# Altium project 175-00024, rev2, Backplane, Instrument Crate.PrjPCB
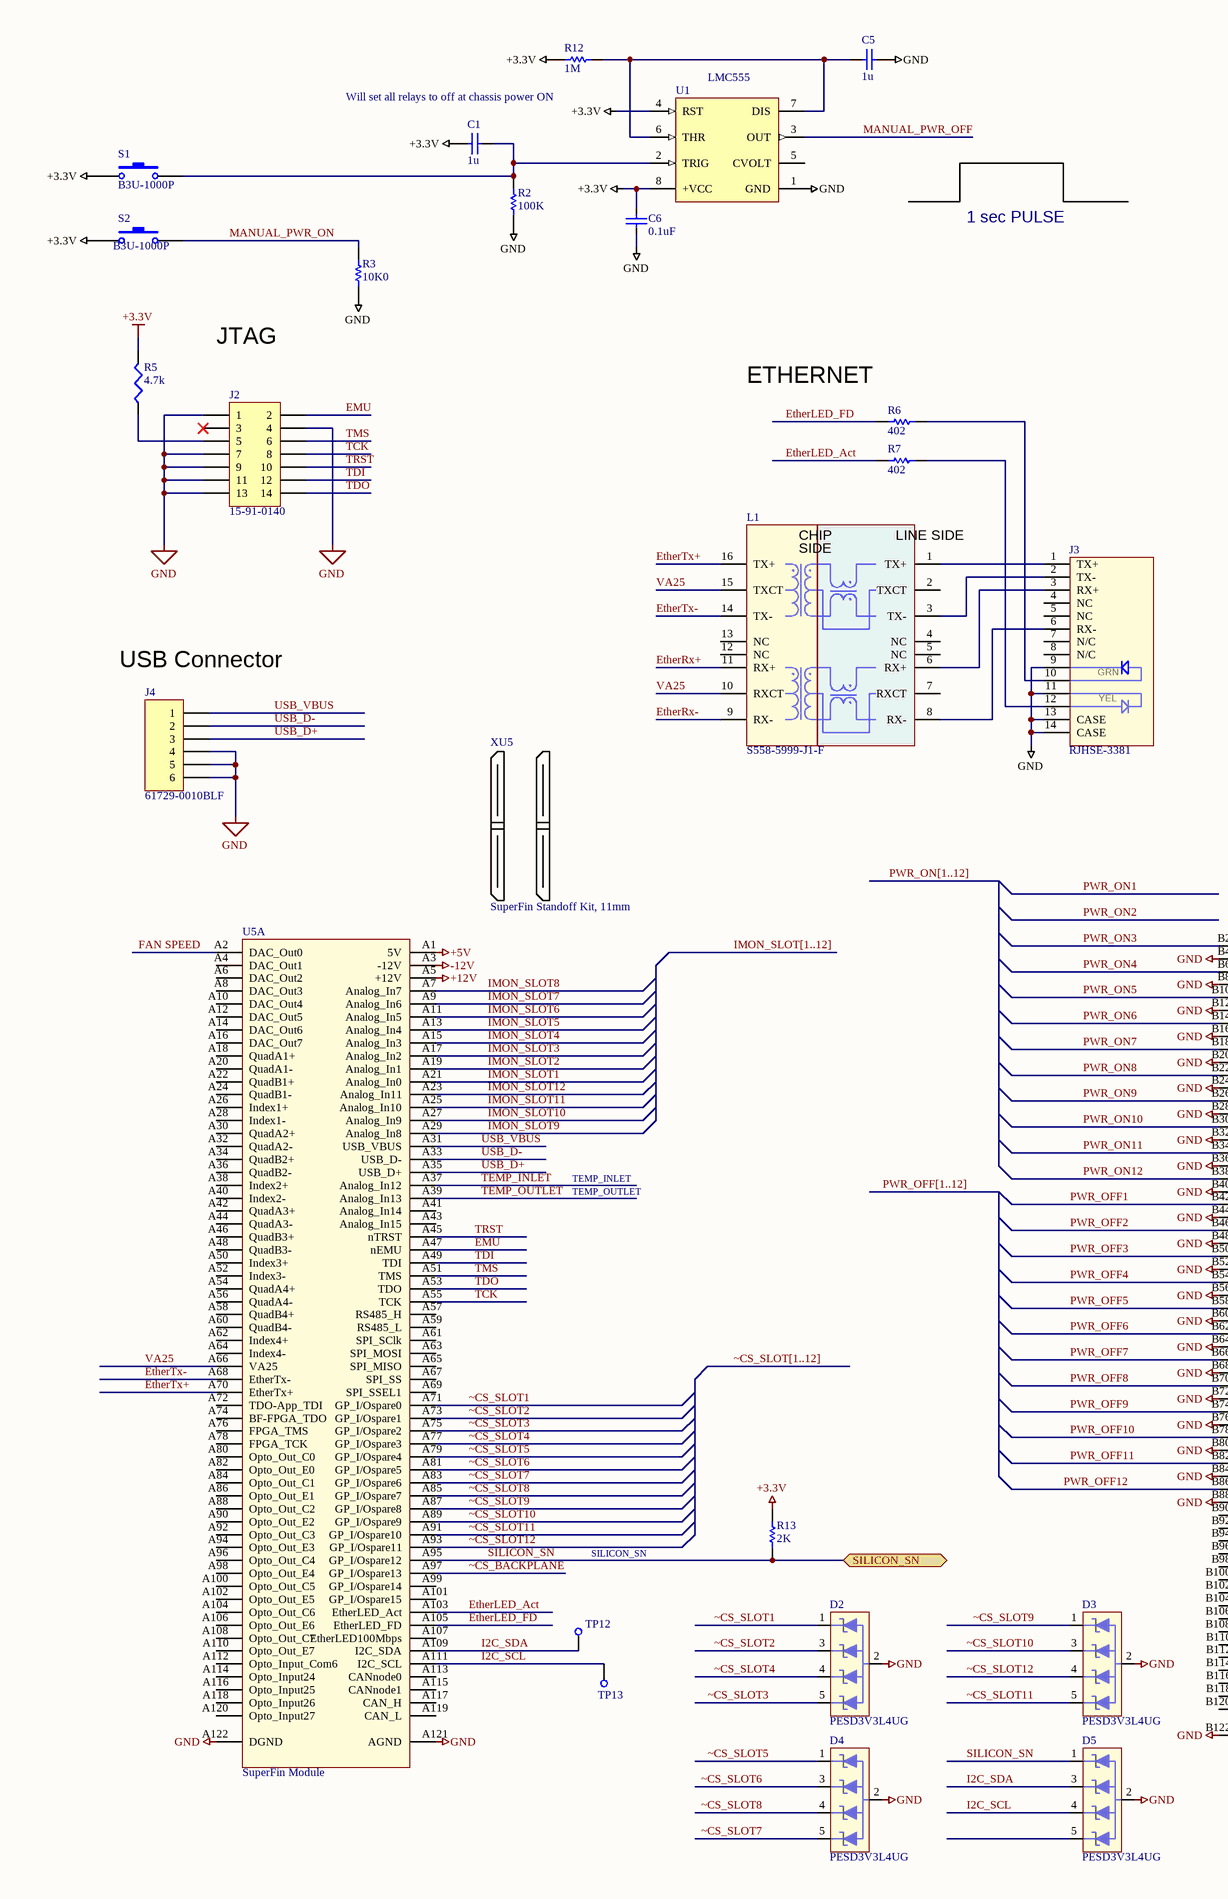
[diagram p0: 780-00029,rev2,Pg3,Backplane, Instrument Crate.SchDoc, left]
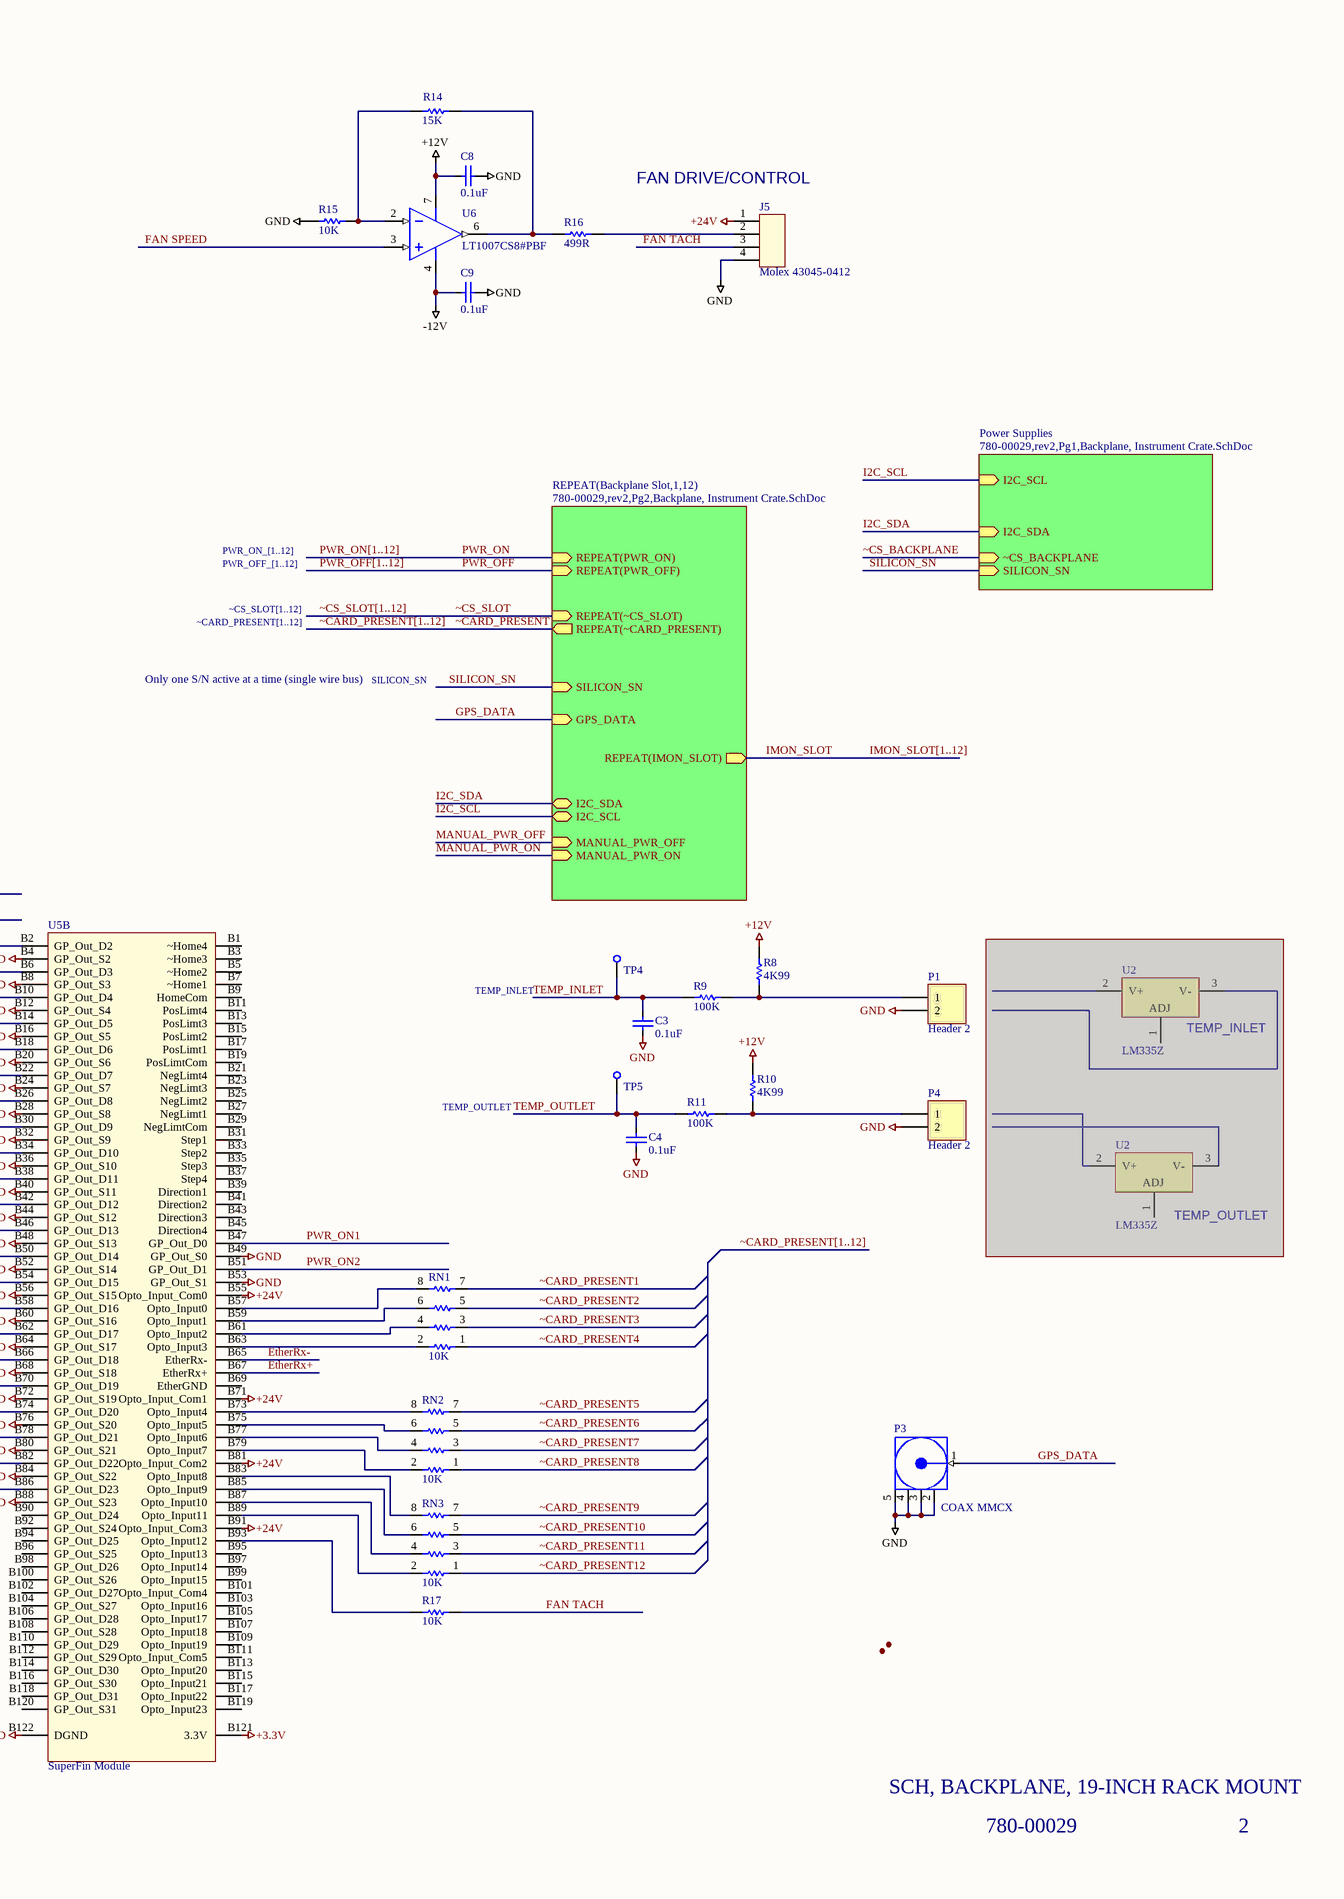
[diagram p1: 780-00029,rev2,Pg3,Backplane, Instrument Crate.SchDoc, right]
2 sheets, 103 parts. Net scope: hierarchical (ports join the sheet entries above them; power ports are global).
Board file: 175-00024_rev2, Backplane, Instrument Crate.PcbDoc
Sheets:
  780-00029,rev2,Pg3,Backplane, Instrument Crate.SchDoc
    Power Supplies = 780-00029,rev2,Pg1,Backplane, Instrument Crate.SchDoc

## Sheet 780-00029,rev2,Pg3,Backplane, Instrument Crate.SchDoc
size C; PageSetup: Record=PageOptions|CenterHorizontal=True|CenterVertical=True|PrintScale=0.70|XCorrection=1.00|YCorrection=1.00|PrintKind=0|BorderSize=5000000|LeftOffset=0|BottomOffset=0|Orientation=2|PaperLength=1000|PaperWidth=1000|Scale=100|PaperSource=7|PrintQuality=-4|MediaType=1|DitherType=10|PaperKind=Tabloid 11 x 17in|PrintScaleMode=1

### Parts
(Parts that share a designator on the sheet are numbered #1, #2 ... from top to bottom, then left to right.)
C1  1u  [2012[0805]]
C3  value 0.1uF  [SMD_0805]  (hidden comment: Cap SMD)
C4  value 0.1uF  [SMD_0805]  (hidden comment: Cap SMD)
C5  1u  [SMD_0805]
C6  value 0.1uF  [SMD_0805]  (hidden comment: Cap SMD)
C8  value 0.1uF  [SMD_0805]  (hidden comment: Cap SMD)
C9  value 0.1uF  [SMD_0805]  (hidden comment: Cap SMD)
D2  PESD3V3L4UG  [SOT-353]
D3  PESD3V3L4UG  [SOT-353]
D4  PESD3V3L4UG  [SOT-353]
D5  PESD3V3L4UG  [SOT-353]
J2  15-91-0140  [HDR2X7]
J3  RJHSE-3381  [RJ45, VERT MOUNT, NO MAGNETICS]
J4  61729-0010BLF  [USB Vertical PCB]
J5  Molex 43045-0412  [CONN Molex Micro-fit, 4 POS]
L1  S558-5999-J1-F  [10/100BT Magetics module]
P1  Header 2  [HDR1X2 for IDC]
P3  COAX MMCX  [MMCX2.54-V5]
P4  Header 2  [HDR1X2 for IDC]
R2  value 100K  [SMD_0805]  (hidden comment: Res 0805)
R3  value 10K0  [SMD_0805]  (hidden comment: Res 0805)
R5  4.7k  [2012[0805]]
R6  value 402  [SMD_0805]  (hidden comment: Res 0805)
R7  value 402  [SMD_0805]  (hidden comment: Res 0805)
R8  value 4K99  [SMD_0805]  (hidden comment: Res 0805)
R9  value 100K  [SMD_0805]  (hidden comment: Res 0805)
R10  value 4K99  [SMD_0805]  (hidden comment: Res 0805)
R11  value 100K  [SMD_0805]  (hidden comment: Res 0805)
R12  value 1M  [SMD_0805]  (hidden comment: Res 0805)
R13  value 2K  [SMD_0805]  (hidden comment: Res 0805)
R14  value 15K  [SMD_0805]  (hidden comment: Res 0805)
R15  value 10K  [SMD_0805]  (hidden comment: Res 0805)
R16  value 499R  [SMD_0805]  (hidden comment: Res 0805)
R17  value 10K  [SMD_0805]  (hidden comment: Res 0805)
RN1  value 10K  [RES ARRAY 0603 x 4]  (hidden comment: RES ARRAY  x4 10K)
RN2  value 10K  [RES ARRAY 0603 x 4]  (hidden comment: RES ARRAY  x4 10K)
RN3  value 10K  [RES ARRAY 0603 x 4]  (hidden comment: RES ARRAY  x4 10K)
S1  B3U-1000P  [B3U-1000P]
S2  B3U-1000P  [B3U-1000P]
TP4  Test Point SMD  [SMD_TEST POINT]  (value not drawn)
TP5  Test Point SMD  [SMD_TEST POINT]  (value not drawn)
TP12  Test Point SMD  [SMD_TEST POINT]  (value not drawn)
TP13  Test Point SMD  [SMD_TEST POINT]  (value not drawn)
U1  value LMC555  [M08A_M]  (hidden comment: LM555CMX)
U2#1  LM335Z  [Z03A]  (masked out: inside a compile mask, not in the netlist)
U2#2  LM335Z  [Z03A]  (masked out: inside a compile mask, not in the netlist)
U5  SuperFin Module  [SuperFin Footprint]  (parts A,B of 2)
U6  LT1007CS8#PBF  [S8_M]
XU5  SuperFin Standoff Kit, 11mm  (mechanical)

### Sub-sheets
Power Supplies = 780-00029,rev2,Pg1,Backplane, Instrument Crate.SchDoc: I2C_SCL (in), I2C_SDA (in), ~CS_BACKPLANE (in), SILICON_SN (in)
REPEAT(Backplane Slot,1,12) = 780-00029,rev2,Pg2,Backplane, Instrument Crate.SchDoc (file not in this document): MANUAL_PWR_OFF (in), MANUAL_PWR_ON (in), REPEAT(PWR_OFF) (in), REPEAT(PWR_ON) (in), GPS_DATA (in), I2C_SDA, I2C_SCL, REPEAT(~CS_SLOT) (in), REPEAT(~CARD_PRESENT) (out), SILICON_SN (in), REPEAT(IMON_SLOT) (out)

### Ports
SILICON_SN (bidir)

### Nets
+3.3V: C1.1 C6.2 R5.2 R12.1 R13.2 S1.1 S2.1 U1.4(RST) U1.8(+VCC) U5.B121(3.3V)
+5V: U5.A1(5V)
+12V: C8.1 R8.2 R10.2 U5.A5(+12V) U6.7(V+)
+24V: J5.1 U5.B55(Opto_Input_Com0) U5.B71(Opto_Input_Com1) U5.B81(Opto_Input_Com2) U5.B91(Opto_Input_Com3)
-12V: C9.1 U5.A3(-12V) U6.4(V-)
GND: C3.1 C4.1 C5.2 C6.1 C8.2 C9.2 D2.2 D3.2 D4.2 D5.2 J2.1 J2.4 J2.7 J2.9 J2.11 J2.13 J3.9(GRN-Anode) J3.11(YEL-Cathode) J3.13(CASE) J3.14(CASE) J4.4 J4.5 J4.6 J5.4 P1.2 P3.2(GND) P3.3(GND) P3.4(GND) P3.5(GND) P4.2 R2.1 R3.1 R15.1 U1.1(GND) U5.A121(AGND) U5.A122(DGND) U5.B4(GP_Out_S2) U5.B8(GP_Out_S3) U5.B12(GP_Out_S4) U5.B16(GP_Out_S5) U5.B20(GP_Out_S6) U5.B24(GP_Out_S7) U5.B28(GP_Out_S8) U5.B32(GP_Out_S9) U5.B36(GP_Out_S10) U5.B40(GP_Out_S11) U5.B44(GP_Out_S12) U5.B48(GP_Out_S13) U5.B49(GP_Out_S0) U5.B52(GP_Out_S14) U5.B53(GP_Out_S1) U5.B56(GP_Out_S15) U5.B60(GP_Out_S16) U5.B64(GP_Out_S17) U5.B68(GP_Out_S18) U5.B72(GP_Out_S19) U5.B76(GP_Out_S20) U5.B80(GP_Out_S21) U5.B84(GP_Out_S22) U5.B88(GP_Out_S23) U5.B122(DGND)
EMU: J2.2 U5.A47(nEMU)
EtherLED_Act: R7.1 U5.A103(EtherLED_Act)
EtherLED_FD: R6.1 U5.A105(EtherLED_FD)
EtherRx+: L1.11(RX+) U5.B67(EtherRx+)
EtherRx-: L1.9(RX-) U5.B65(EtherRx-)
EtherTx+: L1.16(TX+) U5.A70(EtherTx+)
EtherTx-: L1.14(TX-) U5.A68(EtherTx-)
FAN SPEED: U5.A2(DAC_Out0) U6.3(IN+)
FAN TACH: J5.3 R17.2
GPS_DATA: P3.1(Signal) ; sheet REPEAT(Backplane Slot,1,12)/GPS_DATA
I2C_SCL: D5.4 TP13.1(TP) U5.A111(I2C_SCL) ; sheet REPEAT(Backplane Slot,1,12)/I2C_SCL, sheet Power Supplies/I2C_SCL
I2C_SDA: D5.3 TP12.1(TP) U5.A109(I2C_SDA) ; sheet REPEAT(Backplane Slot,1,12)/I2C_SDA, sheet Power Supplies/I2C_SDA
IMON_SLOT: sheet REPEAT(Backplane Slot,1,12)/REPEAT(IMON_SLOT)
IMON_SLOT1: U5.A21(Analog_In0)
IMON_SLOT2: U5.A19(Analog_In1)
IMON_SLOT3: U5.A17(Analog_In2)
IMON_SLOT4: U5.A15(Analog_In3)
IMON_SLOT5: U5.A13(Analog_In4)
IMON_SLOT6: U5.A11(Analog_In5)
IMON_SLOT7: U5.A9(Analog_In6)
IMON_SLOT8: U5.A7(Analog_In7)
IMON_SLOT9: U5.A29(Analog_In8)
IMON_SLOT10: U5.A27(Analog_In9)
IMON_SLOT11: U5.A25(Analog_In10)
IMON_SLOT12: U5.A23(Analog_In11)
MANUAL_PWR_OFF: U1.3(OUT) ; sheet REPEAT(Backplane Slot,1,12)/MANUAL_PWR_OFF
MANUAL_PWR_ON: R3.2 S2.2 ; sheet REPEAT(Backplane Slot,1,12)/MANUAL_PWR_ON
PWR_OFF: sheet REPEAT(Backplane Slot,1,12)/REPEAT(PWR_OFF)
PWR_OFF1: U5.B42(GP_Out_D12)
PWR_OFF2: U5.B46(GP_Out_D13)
PWR_OFF3: U5.B50(GP_Out_D14)
PWR_OFF4: U5.B54(GP_Out_D15)
PWR_OFF5: U5.B58(GP_Out_D16)
PWR_OFF6: U5.B62(GP_Out_D17)
PWR_OFF7: U5.B66(GP_Out_D18)
PWR_OFF8: U5.B70(GP_Out_D19)
PWR_OFF9: U5.B74(GP_Out_D20)
PWR_OFF10: U5.B78(GP_Out_D21)
PWR_OFF11: U5.B82(GP_Out_D22)
PWR_OFF12: U5.B86(GP_Out_D23)
PWR_ON: sheet REPEAT(Backplane Slot,1,12)/REPEAT(PWR_ON)
PWR_ON1: U5.B47(GP_Out_D0)
PWR_ON2: U5.B51(GP_Out_D1)
PWR_ON3: U5.B2(GP_Out_D2)
PWR_ON4: U5.B6(GP_Out_D3)
PWR_ON5: U5.B10(GP_Out_D4)
PWR_ON6: U5.B14(GP_Out_D5)
PWR_ON7: U5.B18(GP_Out_D6)
PWR_ON8: U5.B22(GP_Out_D7)
PWR_ON9: U5.B26(GP_Out_D8)
PWR_ON10: U5.B30(GP_Out_D9)
PWR_ON11: U5.B34(GP_Out_D10)
PWR_ON12: U5.B38(GP_Out_D11)
SILICON_SN: D5.1 R13.1 U5.A95(GP_I/Ospare12) ; port SILICON_SN, sheet REPEAT(Backplane Slot,1,12)/SILICON_SN, sheet Power Supplies/SILICON_SN
TCK: J2.8 U5.A55(TCK)
TDI: J2.12 U5.A49(TDI)
TDO: J2.14 U5.A53(TDO)
TEMP_INLET: C3.2 R9.1 TP4.1(TP) U5.A37(Analog_In12)
TEMP_OUTLET: C4.2 R11.1 TP5.1(TP) U5.A39(Analog_In13)
TMS: J2.6 U5.A51(TMS)
TRST: J2.10 U5.A45(nTRST)
USB_D+: J4.3 U5.A35(USB_D+)
USB_D-: J4.2 U5.A33(USB_D-)
USB_VBUS: J4.1 U5.A31(USB_VBUS)
VA25: L1.10(RXCT) L1.15(TXCT) U5.A66(VA25)
~CARD_PRESENT: sheet REPEAT(Backplane Slot,1,12)/REPEAT(~CARD_PRESENT)
~CARD_PRESENT1: RN1.7
~CARD_PRESENT2: RN1.5
~CARD_PRESENT3: RN1.3
~CARD_PRESENT4: RN1.1
~CARD_PRESENT5: RN2.7
~CARD_PRESENT6: RN2.5
~CARD_PRESENT7: RN2.3
~CARD_PRESENT8: RN2.1
~CARD_PRESENT9: RN3.7
~CARD_PRESENT10: RN3.5
~CARD_PRESENT11: RN3.3
~CARD_PRESENT12: RN3.1
~CS_BACKPLANE: U5.A97(GP_I/Ospare13) ; sheet Power Supplies/~CS_BACKPLANE
~CS_SLOT: sheet REPEAT(Backplane Slot,1,12)/REPEAT(~CS_SLOT)
~CS_SLOT1: D2.1 U5.A71(GP_I/Ospare0)
~CS_SLOT2: D2.3 U5.A73(GP_I/Ospare1)
~CS_SLOT3: D2.5 U5.A75(GP_I/Ospare2)
~CS_SLOT4: D2.4 U5.A77(GP_I/Ospare3)
~CS_SLOT5: D4.1 U5.A79(GP_I/Ospare4)
~CS_SLOT6: D4.3 U5.A81(GP_I/Ospare5)
~CS_SLOT7: D4.5 U5.A83(GP_I/Ospare6)
~CS_SLOT8: D4.4 U5.A85(GP_I/Ospare7)
~CS_SLOT9: D3.1 U5.A87(GP_I/Ospare8)
~CS_SLOT10: D3.3 U5.A89(GP_I/Ospare9)
~CS_SLOT11: D3.5 U5.A91(GP_I/Ospare10)
~CS_SLOT12: D3.4 U5.A93(GP_I/Ospare11)
NetC1_2: C1.2 R2.2 S1.2 U1.2(TRIG)
NetC5_1: C5.1 R12.2 U1.6(THR) U1.7(DIS)
NetJ2_5: J2.5 R5.1
NetJ3_1: J3.1(TX+) L1.1(TX+)
NetJ3_2: J3.2(TX-) L1.3(TX-)
NetJ3_3: J3.3(RX+) L1.6(RX+)
NetJ3_6: J3.6(RX-) L1.8(RX-)
NetJ3_10: J3.10(GRN-Cathode) R6.2
NetJ3_12: J3.12(YEL-Anode) R7.2
NetJ5_2: J5.2 R16.1
NetP1_1: P1.1 R8.1 R9.2
NetP4_1: P4.1 R10.1 R11.2
NetR14_1: R14.1 R15.2 U6.2(IN-)
NetR14_2: R14.2 R16.2 U6.6(OUT)
NetR17_1: R17.1 U5.B93(Opto_Input12)
NetRN1_2: RN1.2 U5.B63(Opto_Input3)
NetRN1_4: RN1.4 U5.B61(Opto_Input2)
NetRN1_6: RN1.6 U5.B59(Opto_Input1)
NetRN1_8: RN1.8 U5.B57(Opto_Input0)
NetRN2_2: RN2.2 U5.B79(Opto_Input7)
NetRN2_4: RN2.4 U5.B77(Opto_Input6)
NetRN2_6: RN2.6 U5.B75(Opto_Input5)
NetRN2_8: RN2.8 U5.B73(Opto_Input4)
NetRN3_2: RN3.2 U5.B89(Opto_Input11)
NetRN3_4: RN3.4 U5.B87(Opto_Input10)
NetRN3_6: RN3.6 U5.B85(Opto_Input9)
NetRN3_8: RN3.8 U5.B83(Opto_Input8)

Not connected (* = marked no-connect by the designer): D5 5; J2 3*; J3 4(NC) 5(NC) 7(N/C) 8(N/C); L1 2(TXCT) 4(NC) 5(NC) 7(RXCT) 12(NC) 13(NC); U1 5(CVOLT); U5 A4(DAC_Out1) A6(DAC_Out2) A8(DAC_Out3) A10(DAC_Out4) A12(DAC_Out5) A14(DAC_Out6) A16(DAC_Out7) A18(QuadA1+) A20(QuadA1-) A22(QuadB1+) A24(QuadB1-) A26(Index1+) A28(Index1-) A30(QuadA2+) A32(QuadA2-) A34(QuadB2+) A36(QuadB2-) A38(Index2+) A40(Index2-) A41(Analog_In14) A42(QuadA3+) A43(Analog_In15) A44(QuadA3-) A46(QuadB3+) A48(QuadB3-) A50(Index3+) A52(Index3-) A54(QuadA4+) A56(QuadA4-) A57(RS485_H) A58(QuadB4+) A59(RS485_L) A60(QuadB4-) A61(SPI_SClk) A62(Index4+) A63(SPI_MOSI) A64(Index4-) A65(SPI_MISO) A67(SPI_SS) A69(SPI_SSEL1) A72(TDO-App_TDI) A74(BF-FPGA_TDO) A76(FPGA_TMS) A78(FPGA_TCK) A80(Opto_Out_C0) A82(Opto_Out_E0) A84(Opto_Out_C1) A86(Opto_Out_E1) A88(Opto_Out_C2) A90(Opto_Out_E2) A92(Opto_Out_C3) A94(Opto_Out_E3) A96(Opto_Out_C4) A98(Opto_Out_E4) A99(GP_I/Ospare14) A100(Opto_Out_C5) A101(GP_I/Ospare15) A102(Opto_Out_E5) A104(Opto_Out_C6) A106(Opto_Out_E6) A107(EtherLED100Mbps) A108(Opto_Out_C7) A110(Opto_Out_E7) A112(Opto_Input_Com6) A113(CANnode0) A114(Opto_Input24) A115(CANnode1) A116(Opto_Input25) A117(CAN_H) A118(Opto_Input26) A119(CAN_L) A120(Opto_Input27) B1(~Home4) B3(~Home3) B5(~Home2) B7(~Home1) B9(HomeCom) B11(PosLimt4) B13(PosLimt3) B15(PosLimt2) B17(PosLimt1) B19(PosLimtCom) B21(NegLimt4) B23(NegLimt3) B25(NegLimt2) B27(NegLimt1) B29(NegLimtCom) B31(Step1) B33(Step2) B35(Step3) B37(Step4) B39(Direction1) B41(Direction2) B43(Direction3) B45(Direction4) B69(EtherGND) B90(GP_Out_D24) B92(GP_Out_S24) B94(GP_Out_D25) B95(Opto_Input13) B96(GP_Out_S25) B97(Opto_Input14) B98(GP_Out_D26) B99(Opto_Input15) B100(GP_Out_S26) B101(Opto_Input_Com4) B102(GP_Out_D27) B103(Opto_Input16) B104(GP_Out_S27) B105(Opto_Input17) B106(GP_Out_D28) B107(Opto_Input18) B108(GP_Out_S28) B109(Opto_Input19) B110(GP_Out_D29) B111(Opto_Input_Com5) B112(GP_Out_S29) B113(Opto_Input20) B114(GP_Out_D30) B115(Opto_Input21) B116(GP_Out_S30) B117(Opto_Input22) B118(GP_Out_D31) B119(Opto_Input23) B120(GP_Out_S31); U6 1(VOSTRIM) 5(NC) 8(VOSTRIM)

### Buses and harness runs
bus IMON_SLOT[1..12]
bus PWR_OFF[1..12]
bus PWR_ON[1..12]
bus ~CARD_PRESENT[1..12]
bus ~CS_SLOT[1..12]

### Notes on the sheet
- Will set all relays to off at chassis power ON
- (near J5) FAN DRIVE/CONTROL
- 1 sec PULSE
- JTAG
- ETHERNET
- PWR_OFF_[1..12]
- PWR_ON_[1..12]
- ~CARD_PRESENT[1..12]
- ~CS_SLOT[1..12]
- (near J4) USB Connector
- Only one S/N active at a time (single wire bus)
- SILICON_SN
- TEMP_INLET
- (near U2#1) TEMP_INLET
- TEMP_OUTLET
- (near U2#2) TEMP_OUTLET
- SCH, BACKPLANE, 19-INCH RACK MOUNT
- 780-00029
- 2
- (in symbol CONN RJ-45 w/o magnetics) GRN; YEL
- (in symbol Ethernet Magnetics module) CHIP; LINE SIDE; SIDE

### Library data of the parts
C1 C5 = Cap: Capacitor; Manufacturer: Taiyo Yuden; Manuf p/n: UMK212F105ZG-T; Vendor: DIGIKEY; Vendor Mult.: 10; Vendor p/n: 587-1308-1-ND; LCO p/n: 120-00027; Value: 1u; COST: 0.088
C3 C4 C6 C8 C9 = Cap SMD: Capacitor; LCO p/n: 120-00002
D2-D5 = ESD Diode 3.3V Quad: Quad ESD Diode 3.3V; Manufacturer: NXP; Manuf p/n: PESD3V3L4UG,115; LCO p/n: 140-00011; VALUE: 3V3; Vendor: DigiKey; Vendor Mult.: 1; Vendor p/n: 568-4042-1-ND; COST: 0.52
J2 = Header 7X2: Header, 7-Pin, Dual row; Manufacturer: Molex/Waldom; Vendor: DIGIKEY; Vendor Mult.: 1; LCO p/n: 125-00005; Value: HEADER 7X2
J3 = CONN RJ-45 w/o magnetics: Vertical PC mount, w/o magnetics; LCO p/n: 125-00040
J4 = Header 6: Header, 6-Pin; Manufacturer: FCI; Value: USB TYPE B; Vendor: DigiKey; Vendor Mult.: 1; LCO p/n: 125-00039; COST: 1.12
J5 = CONN 4 pin 3mm: Molex Micro Fit 3, Vert PC mount; LCO p/n: 125-00121; Vendor: Digi-Key; Vendor Mult.: 1; Vendor p/n: WM1790-ND; Manufacturer: Molex; Manuf p/n: 43045-0412
L1 = Ethernet Magnetics module: 10/100BT Magnetics Module; LCO p/n: 155-00014
P1 P4 = Header 2: Header, 2-Pin; Manufacturer: TE Connectivity; Manuf p/n: 640456-2; Vendor: Digi-Key; Vendor p/n: A1921-ND; LCO p/n: 125-00110; VALUE: Header 2
P3 = COAX-M: RF Coaxial PCB Connector, MMCX; Thru-Hole, Vertical Mount Plug,  50 Ohm Impedance; Manufacturer: Emerson; Manuf p/n: 135-3701-201; Vendor: DigiKey; Vendor p/n: J597-ND; VALUE: COAX-M; Vendor Mult.: 1; LCO p/n: 125-00054; COST: 5.24
R2 R9 R11 = Res SMD: Resistor 0805; Manufacturer: Vishay/Dale; Manuf p/n: CRCW0805100KFKEA; Vendor: DIGIKEY; Vendor p/n: 541-100KCCT-ND; Vendor Mult.: 10; LCO p/n: 181-01003; COST: 0.09
R3 = Res SMD: Resistor 0805; Manufacturer: Vishay/Dale; Manuf p/n: CRCW080510K0FKEA; Vendor: DIGIKEY; Vendor p/n: 541-10K0CCT-ND; Vendor Mult.: 10; LCO p/n: 181-01002; COST: 0.09
R5 = Res3: Resistor; Manufacturer: Dale/Vishay; Manuf p/n: CRCW08054.75KFKEA; Value: 4.75K; Vendor: DIGIKEY; Vendor Mult.: 10; Vendor p/n: 541-4.75KCCT-ND; LCO p/n: 181-04751; COST: 0.08
R6 R7 = Res SMD: Resistor 0805; Manufacturer: Vishay/Dale; Manuf p/n: CRCW0805402FKEA; Vendor: DIGIKEY; Vendor p/n: 541-402CCT-ND; Vendor Mult.: 10; LCO p/n: 181-04020; COST: 0.09
R8 R10 = Res SMD: Resistor 0805; Manufacturer: Vishay/Dale; Manuf p/n: CRCW08054K99FKEA; Vendor: DIGIKEY; Vendor p/n: 541-4K99CCT-ND; Vendor Mult.: 10; LCO p/n: 181-04991; COST: 0.09
R12 = Res SMD: Resistor 0805; Manufacturer: Vishay/Dale; Vendor: DIGIKEY; LCO p/n: 181-01004; COST: 0.09
R13 = Res SMD: Resistor 0805; Manufacturer: Vishay/Dale; Manuf p/n: CRCW08052KFKEA; Vendor: DIGIKEY; Vendor p/n: 541-2KCCT-ND; Vendor Mult.: 10; LCO p/n: 181-02001; COST: 0.09
R14 = Res SMD: Resistor 0805; Manufacturer: Vishay/Dale; Manuf p/n: CRCW080515KFKEA; Vendor: DIGIKEY; Vendor p/n: 541-15KCCT-ND; Vendor Mult.: 10; LCO p/n: 181-01502; COST: 0.09
R15 R17 = Res SMD: Resistor 0805; Manufacturer: Vishay/Dale; Manuf p/n: CRCW080510KFKEA; Vendor: DIGIKEY; Vendor p/n: 541-10KCCT-ND; Vendor Mult.: 10; LCO p/n: 181-01002; COST: 0.09
R16 = Res SMD: Resistor 0805; Manufacturer: Vishay/Dale; Manuf p/n: CRCW0805499RFKEA; Vendor: DIGIKEY; Vendor p/n: 541-499RCCT-ND; Vendor Mult.: 10; LCO p/n: 181-04990; COST: 0.09
RN1-RN3 = RES ARRAY  x4 10K: Resistor Array 4 Isolated; Manufacturer: PANASONIC - ECG; Manuf p/n: EXB-38V103JV; Vendor: DIGIKEY; Vendor p/n: Y9103CT-ND; Vendor Mult.: 10; LCO p/n: 180-00043; COST: 0.03
S1 S2 = SW-PB: Switch; Manufacturer: Omron Electronics; Vendor: DIGIKEY; Vendor Mult.: 1; Vendor p/n: SW1020CT-ND; Value: SW PB; LCO p/n: 185-00005; COST: 0.96; Manuf p/n: B3U-1000P
TP4 TP5 TP12 TP13 = Test Point SMD: SMD loop test point; LCO p/n: 160-00001; VALUE: Test Point SMD
U1 = LM555CMX: Timer; Manufacturer: National Semiconductor; Manuf p/n: LMC555CMX/NOPB; LCO p/n: 150-00090; Vendor: Digi-Key; Vendor Mult.: 1; Vendor p/n: LMC555CMXCT-ND
U2#1 U2#2 = LM335Z: Precision Temperature Sensor; Manufacturer: National Semiconductor; LCO p/n: 150-00068
U5 = SuperFin Module: LCO p/n: 830-00010
U6 = LT1007CS8#PBF: Low Noise BJT input opamp; Manufacturer: Linear Tech; LCO p/n: 150-00067; VALUE: LT1007; Vendor: DigiKey; Vendor Mult.: 1; Vendor p/n: LT1007CS8#PBF-ND; COST: 4.13; Manuf p/n: LT1007CS8#PBF
XU5 = SuperFin Standoff Kit, 11mm: LCO p/n: 810-00005

## Sheet 780-00029,rev2,Pg1,Backplane, Instrument Crate.SchDoc
size B; PageSetup: Record=PageOptions|CenterHorizontal=True|CenterVertical=True|PrintScale=1.09|XCorrection=1.00|YCorrection=1.00|PrintKind=0|BorderSize=5000000|LeftOffset=0|BottomOffset=0|Orientation=2|PaperLength=1000|PaperWidth=1000|Scale=100|PaperSource=7|PrintQuality=-4|MediaType=1|DitherType=10|PaperKind=Tabloid 11 x 17in|PrintScaleMode=1
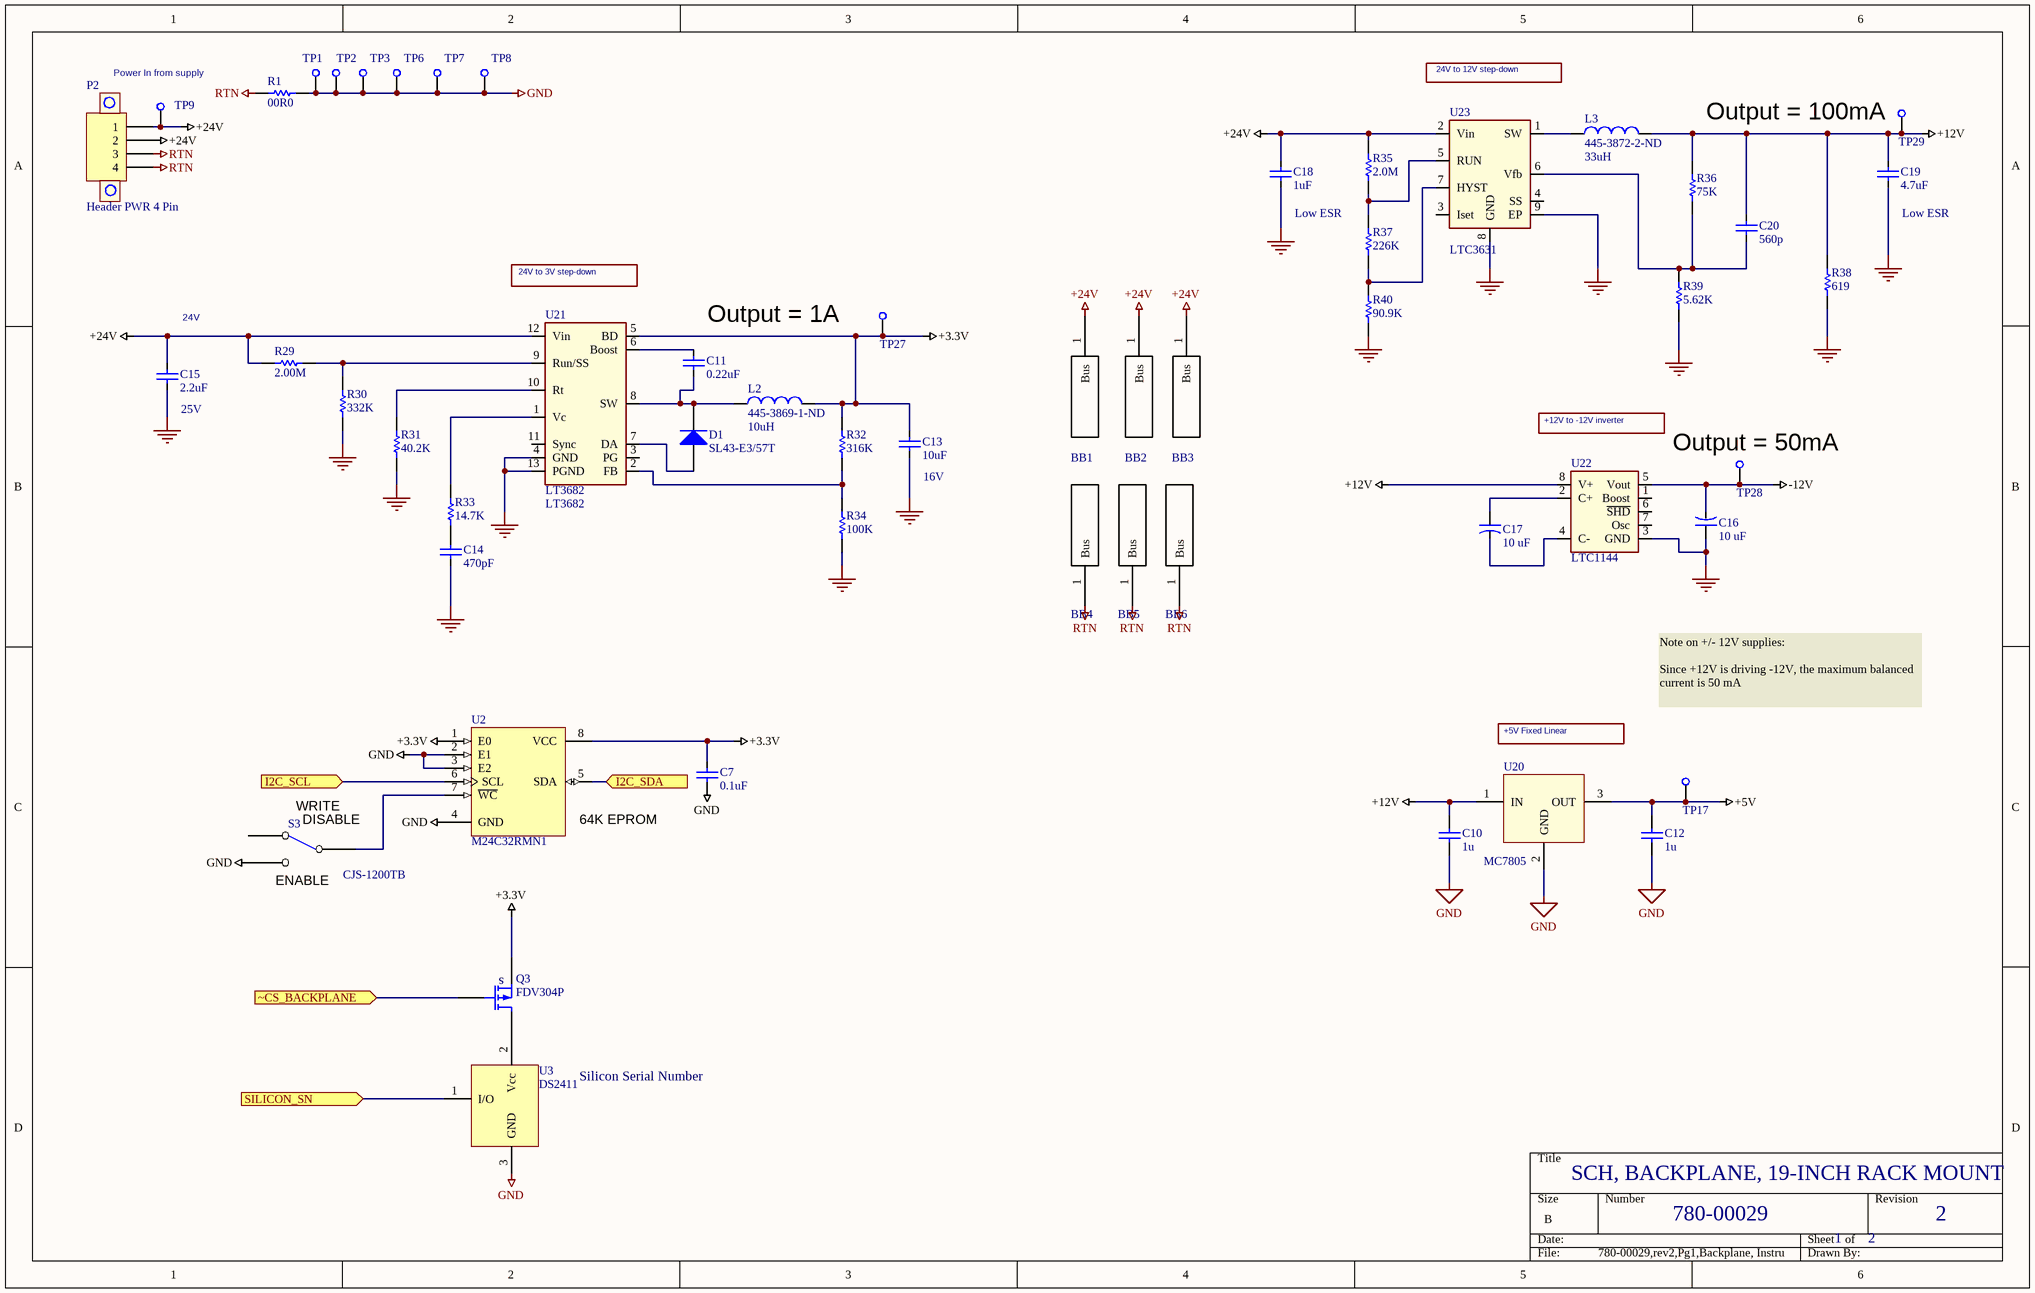
[diagram p2: 780-00029,rev2,Pg1,Backplane, Instrument Crate.SchDoc]

### Parts
(Parts that share a designator on the sheet are numbered #1, #2 ... from top to bottom, then left to right.)
BB1  Bus Bar  [Bus Bar 1.5" pitch]  (value not drawn)
BB2  Bus Bar  [Bus Bar 1.5" pitch]  (value not drawn)
BB3  Bus Bar  [Bus Bar 1.5" pitch]  (value not drawn)
BB4  Bus Bar  [Bus Bar 1.5" pitch]  (value not drawn)
BB5  Bus Bar  [Bus Bar 1.5" pitch]  (value not drawn)
BB6  Bus Bar  [Bus Bar 1.5" pitch]  (value not drawn)
C7  value 0.1uF  [SMD_0805]  (hidden comment: Cap SMD)
C10  1u  [2012[0805]]
C11  value 0.22uF  [SMD_0805]  (hidden comment: Cap SMD)
C12  1u  [2012[0805]]
C13  16V  value 10uF  [SMD_0805]
C14  value 470pF  [SMD_0805]  (hidden comment: Cap SMD)
C15  25V  value 2.2uF  [SMD_0805]
C16  value 10 uF  [SMD_CAP_3216]  (hidden comment: 16V)
C17  value 10 uF  [SMD_CAP_3216]  (hidden comment: 16V)
C18  Low ESR  value 1uF  [SMD_1206]
C19  Low ESR  value 4.7uF  [SMD_1206]
C20  value 560p  [SMD_0805]  (hidden comment: Cap SMD)
D1  SL43-E3/57T  [DO-214AB]
L2  445-3869-1-ND  value 10uH  [Inductor TDC SLF]
L3  445-3872-2-ND  value 33uH  [Inductor TDC SLF]
P2  Header PWR 4 Pin  [HDR-4 pin w/screw]
Q3  FDV304P  [SMD_SOT23_3]
R1  value 00R0  [SMD_0805]  (hidden comment: Res 0805)
R29  value 2.00M  [SMD_0805]  (hidden comment: Res 0805)
R30  value 332K  [SMD_0805]  (hidden comment: Res 0805)
R31  value 40.2K  [SMD_0805]  (hidden comment: Res 0805)
R32  value 316K  [SMD_0805]  (hidden comment: Res 0805)
R33  value 14.7K  [SMD_0805]  (hidden comment: Res 0805)
R34  value 100K  [SMD_0805]  (hidden comment: Res 0805)
R35  value 2.0M  [SMD_0805]  (hidden comment: Res 0805)
R36  value 75K  [SMD_0805]  (hidden comment: Res 0805)
R37  value 226K  [SMD_0805]  (hidden comment: Res 0805)
R38  value 619  [SMD_0805]  (hidden comment: Res 0805)
R39  value 5.62K  [SMD_0805]  (hidden comment: Res 0805)
R40  value 90.9K  [SMD_0805]  (hidden comment: Res 0805)
S3  CJS-1200TB  [CAS-120B]
TP1  Test point  [PAD_80D_052H]  (value not drawn)
TP2  Test point  [PAD_80D_052H]  (value not drawn)
TP3  Test point  [PAD_80D_052H]  (value not drawn)
TP6  Test point  [PAD_80D_052H]  (value not drawn)
TP7  Test point  [PAD_80D_052H]  (value not drawn)
TP8  Test point  [PAD_80D_052H]  (value not drawn)
TP9  Test Point SMD  [SMD_TEST POINT]  (value not drawn)
TP17  Test Point SMD  [SMD_TEST POINT]  (value not drawn)
TP27  Test Point SMD  [SMD_TEST POINT]  (value not drawn)
TP28  Test Point SMD  [SMD_TEST POINT]  (value not drawn)
TP29  Test Point SMD  [SMD_TEST POINT]  (value not drawn)
U2#3  M24C32RMN1  [SOP8_N]
U3  DS2411  [SMD_SOT23_3]
U20  value MC7805  [TO-252(D-PAK)  PowerPAD]  (hidden comment: Voltage Reg, Fixed)
U21  LT3682  [DD12/DFN12]
U22  LTC1144  [S8_M]
U23  LTC3631  [DD8/DFN8]

### Ports
I2C_SCL (in), I2C_SDA (in), SILICON_SN (in), ~CS_BACKPLANE (in)

### Nets
+3.3V: C7.2 C13.2 L2.2 Q3.2(S) R32.2 TP27.1(TP) U2#3.1(E0) U2#3.8(VCC) U21.5(BD)
+5V: C12.1 TP17.1(TP) U20.3(OUT)
+12V: C10.1 C19.2 C20.2 L3.2 R36.2 R38.2 TP29.1(TP) U20.1(IN) U22.8(V+)
+24V: BB1.1(Bus) BB2.1(Bus) BB3.1(Bus) C15.2 C18.2 P2.1 P2.2 R29.1 R35.2 TP9.1(TP) U21.12(Vin) U23.2(Vin)
-12V: C16.2 TP28.1(TP) U22.5(Vout)
GND: C7.1 C10.2 C12.2 C13.1 C14.1 C15.1 C16.1 C18.1 C19.1 R1.2 R30.1 R31.1 R34.1 R38.1 R39.1 R40.1 S3.1(NO) TP1.1(TP) TP2.1(TP) TP3.1(TP) TP6.1(TP) TP7.1(TP) TP8.1(TP) U2#3.2(E1) U2#3.3(E2) U2#3.4(GND) U3.3(GND) U20.2(GND) U21.4(GND) U21.13(PGND) U22.3(GND) U23.8(GND) U23.9(EP)
RTN: BB4.1(Bus) BB5.1(Bus) BB6.1(Bus) P2.3 P2.4 R1.1
I2C_SCL: U2#3.6(SCL) ; port I2C_SCL
I2C_SDA: U2#3.5(SDA) ; port I2C_SDA
SILICON_SN: U3.1(I/O) ; port SILICON_SN
~CS_BACKPLANE: Q3.1(G) ; port ~CS_BACKPLANE
NetC11_1: C11.1 D1.2(K) L2.1 U21.8(SW)
NetC11_2: C11.2 U21.6(Boost)
NetC14_2: C14.2 R33.1
NetC17_1: C17.1 U22.2(C+)
NetC17_2: C17.2 U22.4(C-)
NetC20_1: C20.1 R36.1 R39.2 U23.6(Vfb)
NetD1_1: D1.1(A) U21.7(DA)
NetL3_1: L3.1 U23.1(SW)
NetQ3_3: Q3.3(D) U3.2(Vcc)
NetR29_2: R29.2 R30.2 U21.9(Run/SS)
NetR31_2: R31.2 U21.10(Rt)
NetR32_1: R32.1 R34.2 U21.2(FB)
NetR33_2: R33.2 U21.1(Vc)
NetR35_1: R35.1 R37.2 U23.5(RUN)
NetR37_1: R37.1 R40.2 U23.7(HYST)
NetS3_2: S3.2(COM) U2#3.7(~{WC})

Not connected (* = marked no-connect by the designer): S3 3(NC); U21 3(PG) 11(Sync); U22 1(Boost) 6(~{SHD}) 7(Osc); U23 3(Iset) 4(SS)

### Notes on the sheet
- Power In from supply
- 24V to 12V step-down
- Output = 100mA
- 24V to 3V step-down
- (near C15) 24V
- Output = 1A
- +12V to -12V inverter
- (near TP28) Output = 50mA
- Note on +/- 12V supplies:
  Since +12V is driving -12V, the maximum balanced current is 50 mA
- +5V Fixed Linear
- (near S3) WRITE
- (near S3) DISABLE
- (near U2#3) 64K EPROM
- (near S3) ENABLE
- Silicon Serial Number
- SCH, BACKPLANE, 19-INCH RACK MOUNT
- 780-00029
- 1
- 2
- (in symbol FDV304P) s

### Library data of the parts
BB1-BB6 = Bus Bar: Manufacturer: Circuit Components Inc.; Manuf p/n: B250-4-1.5-FO; LCO p/n: 160-00005; Value: Bus Bar; Vendor: Circuit Components Inc.; Vendor p/n: B250-4-1.5-FO
C7 = Cap SMD: Capacitor; Manufacturer: AVX; Manuf p/n: 08055C104KAT2A; Vendor: DigiKey; Vendor p/n: 478-1395-1-ND; Vendor Mult.: 10; LCO P/N: 120-00002; COST: 0.088
C10 C12 = Cap: as C1 on sheet 780-00029,rev2,Pg3,Backplane, Instrument Crate; Value: 1u; COST: 0.088
C11 = Cap SMD: Capacitor; LCO p/n: 120-00042
C13 = Cap SMD: Capacitor; LCO p/n: 120-00007
C14 = Cap SMD: Capacitor; LCO p/n: 120-00037
C15 = Cap SMD: Capacitor; Manufacturer: Taiyo Yuden; Manuf p/n: TMK212BJ225KG-T; Vendor: Digi-Key; Vendor p/n: 587-1292-1-ND; Vendor Mult.: 10; LCO p/n: 120-00038; COST: 0.275
C16 C17 = Cap Tant 16V: outline 3.2mm x 1.6mm; Manufacturer: KEMET; Manuf p/n: T494A106M016AT; Vendor: DIGIKEY; Vendor p/n: 399-3824-1-ND; Vendor Mult.: 1; LCO p/n: 120-00001; COST: 0.78
C18 = Cap SMD: Capacitor; Manufacturer: TDK; Manuf p/n: C3225X7R1H105K/1.6; Vendor: Digi-Key; Vendor p/n: 445-3931-1-ND; Vendor Mult.: 10; LCO p/n: 120-00039
C19 = Cap SMD: Capacitor; Manufacturer: TDK; Manuf p/n: C3216X7R1E475K; Vendor: Digi-Key; Vendor p/n: 445-1606-1-ND; Vendor Mult.: 10; LCO p/n: 120-00040
C20 = Cap SMD: Capacitor; LCO p/n: 120-00036
D1 = Diode: Default Diode; Manufacturer: Vishay/Dale; Value: 4A 30V; Vendor: DigiKey; Vendor Mult.: 1; Vendor p/n: SL43-E3/57TGICT-ND; LCO p/n: 140-00002; COST: 0.98; Manuf p/n: SL43-E3/57T
L2 = Inductor SMD 10uH 1.8A: Inductor; Manufacturer: TDK; Manuf p/n: SLF7045T-100M1R8-H; Vendor: Digi-Key; Vendor Mult.: 1; LCO p/n: 155-00015; Vendor p/n: 445-3869-1-ND
L3 = Inductor SMD 10uH 1.8A: Inductor; Manufacturer: TDK; Manuf p/n: SLF7045T-330M1R1-H; Vendor: Digi-Key; Vendor Mult.: 1; LCO p/n: 155-00016; Vendor p/n: 445-3872-2-ND
P2 = Header 4 PWR: Header, 4-Pin; Manufacturer: tyco; Manuf p/n: 796867-4; Vendor: Digi-key; Vendor p/n: A98457-ND; Vendor Mult.: 1; LCO p/n: 125-00082; VALUE: Header 4-pin PWR
Q3 = FDV304P: P-MOSFET LOGIC LEVEL; Manufacturer: Fairchild; Vendor: DigiKey; Vendor p/n: FDV304PCT-ND; Vendor Mult.: 1; LCO P/N: 195-00004; COST: 0.46; Manuf p/n: FDV304P; Value: FDV304P
R1 = Res SMD: Resistor 0805; Manufacturer: Vishay/Dale; Manuf p/n: CRCW080500R0FKEA; Vendor: DIGIKEY; Vendor p/n: 541-00R0CCT-ND; Vendor Mult.: 10; LCO p/n: 180-00033; COST: 0.09
R29 = Res SMD: Resistor 0805; Manufacturer: Vishay/Dale; Manuf p/n: CRCW08052.00MFKEA; Vendor: DIGIKEY; Vendor p/n: 541-2.00MCCT-ND; Vendor Mult.: 10; LCO p/n: 181-02004; COST: 0.09
R30 = Res SMD: Resistor 0805; Manufacturer: Vishay/Dale; Manuf p/n: CRCW0805332KFKEA; Vendor: DIGIKEY; Vendor p/n: 541-332KCCT-ND; Vendor Mult.: 10; LCO p/n: 181-03323; COST: 0.09
R31 = Res SMD: Resistor 0805; Manufacturer: Vishay/Dale; Manuf p/n: CRCW080540.2KFKEA; Vendor: DIGIKEY; Vendor p/n: 541-40.2KCCT-ND; Vendor Mult.: 10; LCO p/n: 181-04021; COST: 0.09
R32 = Res SMD: Resistor 0805; Manufacturer: Vishay/Dale; Manuf p/n: CRCW0805316KFKEA; Vendor: DIGIKEY; Vendor p/n: 541-316KCCT-ND; Vendor Mult.: 10; LCO p/n: 181-03163; COST: 0.09
R33 = Res SMD: Resistor 0805; Manufacturer: Vishay/Dale; Manuf p/n: CRCW080514.7KFKEA; Vendor: DIGIKEY; Vendor p/n: 541-14.7KCCT-ND; Vendor Mult.: 10; LCO p/n: 181-01472; COST: 0.09
R34 = Res SMD: as R2 on sheet 780-00029,rev2,Pg3,Backplane, Instrument Crate; COST: 0.09
R35 = Res SMD: Resistor 0805; Manufacturer: Vishay/Dale; Manuf p/n: CRCW08052.0MFKEA; Vendor: DIGIKEY; Vendor p/n: 541-2.0MCCT-ND; Vendor Mult.: 10; LCO p/n: 181-02004; COST: 0.09
R36 = Res SMD: Resistor 0805; Manufacturer: Vishay/Dale; Manuf p/n: CRCW080575KFKEA; Vendor: DIGIKEY; Vendor p/n: 541-75KCCT-ND; Vendor Mult.: 10; LCO p/n: 181-07502; COST: 0.09
R37 = Res SMD: Resistor 0805; Manufacturer: Vishay/Dale; Manuf p/n: CRCW0805226KFKEA; Vendor: DIGIKEY; Vendor p/n: 541-226KCCT-ND; Vendor Mult.: 10; LCO p/n: 181-02263; COST: 0.09
R38 = Res SMD: Resistor 0805; Manufacturer: Vishay/Dale; Manuf p/n: CRCW0805619FKEA; Vendor: DIGIKEY; Vendor p/n: 541-619CCT-ND; Vendor Mult.: 10; LCO p/n: 181-06190; COST: 0.09
R39 = Res SMD: Resistor 0805; Manufacturer: Vishay/Dale; Manuf p/n: CRCW08055.62KFKEA; Vendor: DIGIKEY; Vendor p/n: 541-5.62KCCT-ND; Vendor Mult.: 10; LCO p/n: 181-05621; COST: 0.09
R40 = Res SMD: Resistor 0805; Manufacturer: Vishay/Dale; Manuf p/n: CRCW080590.9KFKEA; Vendor: DIGIKEY; Vendor p/n: 541-90.9KCCT-ND; Vendor Mult.: 10; LCO p/n: 181-09092; COST: 0.09
S3 = SW_SPDT_DOUG: Manufacturer: Copal Electronics; Manuf p/n: CAS-120TA; Vendor: DIGIKEY; Vendor Mult.: 1; Vendor p/n: CAS120JTR-ND; LCO p/n: 185-00010; COST: 1.27; Value: SW_SPDT
TP1-TP3 TP6-TP8 = Test point: Manufacturer: Keystone; Manuf p/n: 1249; Vendor: Bisco Ind.; LCO p/n: 125-00013; Vendor p/n: 1249; COST: 0.18; VALUE: Test point
TP9 TP17 TP27-TP29 = Test Point SMD: SMD loop test point; LCO p/n: 160-00001; VALUE: Test Point SMD
U2#3 = M24C32RMN1: 32 Kbit Serial I²C Bus EEPROM; LCO p/n: 150-00076
U3 = DS2411: Silicon Serial Number; Manufacturer: MAXIM; Manuf p/n: DS2411R+T&R; Vendor: DIGIKEY; Vendor p/n: DS2411R+CT-ND; Vendor Mult.: 1; LCO p/n: 150-00031; COST: 1.25; VALUE: DS2411
U20 = Voltage Reg, Fixed: MC78M05; Manufacturer: Fairchild; Manuf p/n: MC78M05CDTX; LCO p/n: 150-00101; Vendor: Digi-Key; Vendor Mult.: 1; Vendor p/n: MC78M05CDTXCT-ND; COST: 0.61
U21 = LT3682: 1A uPwr Step-Down switching regulator; Manufacturer: Linear; Manuf p/n: LT3682EDD#PBF; LCO p/n: 150-00069; Vendor: Digi-Key; Vendor Mult.: 1; Vendor p/n: LT3682EDD#PBF-ND; COST: 6.28; VALUE: LT3682
U22 = LTC1144: IC VOLT CONV SW-CAP W/SHTDN8SOIC; Manufacturer: Linear; Manuf p/n: LTC1144CS8#PBF; LCO p/n: 150-00070; Vendor: Digi_Key; Vendor Mult.: 1; Vendor p/n: LTC1144CS8#PBF-ND; COST: 4.90; VALUE: LTC1144
U23 = LTC3631: IC CONV STP-DWN ADJ 8-DFN; Manufacturer: Linear; Manuf p/n: LTC3631EDD#PBF; LCO p/n: 150-00071; Vendor: Digi-Key; Vendor Mult.: 1; Vendor p/n: LTC3631EDD#PBF-ND; COST: 6.28; VALUE: LTC3631

## Nets that join several sheets
+3.3V: 780-00029,rev2,Pg3,Backplane, Instrument Crate (10 pins), 780-00029,rev2,Pg1,Backplane, Instrument Crate (9 pins)
+5V: 780-00029,rev2,Pg3,Backplane, Instrument Crate (U5.A1), 780-00029,rev2,Pg1,Backplane, Instrument Crate (C12.1 TP17.1 U20.3)
+12V: 780-00029,rev2,Pg3,Backplane, Instrument Crate (5 pins), 780-00029,rev2,Pg1,Backplane, Instrument Crate (9 pins)
+24V: 780-00029,rev2,Pg3,Backplane, Instrument Crate (5 pins), 780-00029,rev2,Pg1,Backplane, Instrument Crate (12 pins)
-12V: 780-00029,rev2,Pg3,Backplane, Instrument Crate (C9.1 U5.A3 U6.4), 780-00029,rev2,Pg1,Backplane, Instrument Crate (C16.2 TP28.1 U22.5)
GND: 780-00029,rev2,Pg3,Backplane, Instrument Crate (61 pins), 780-00029,rev2,Pg1,Backplane, Instrument Crate (33 pins)
I2C_SCL: 780-00029,rev2,Pg3,Backplane, Instrument Crate (D5.4 TP13.1 U5.A111), 780-00029,rev2,Pg1,Backplane, Instrument Crate (U2#3.6)
I2C_SDA: 780-00029,rev2,Pg3,Backplane, Instrument Crate (D5.3 TP12.1 U5.A109), 780-00029,rev2,Pg1,Backplane, Instrument Crate (U2#3.5)
SILICON_SN: 780-00029,rev2,Pg3,Backplane, Instrument Crate (D5.1 R13.1 U5.A95), 780-00029,rev2,Pg1,Backplane, Instrument Crate (U3.1)
~CS_BACKPLANE: 780-00029,rev2,Pg3,Backplane, Instrument Crate (U5.A97), 780-00029,rev2,Pg1,Backplane, Instrument Crate (Q3.1)